# EAGLE design v2.1 (EAGLE 6.5.0)
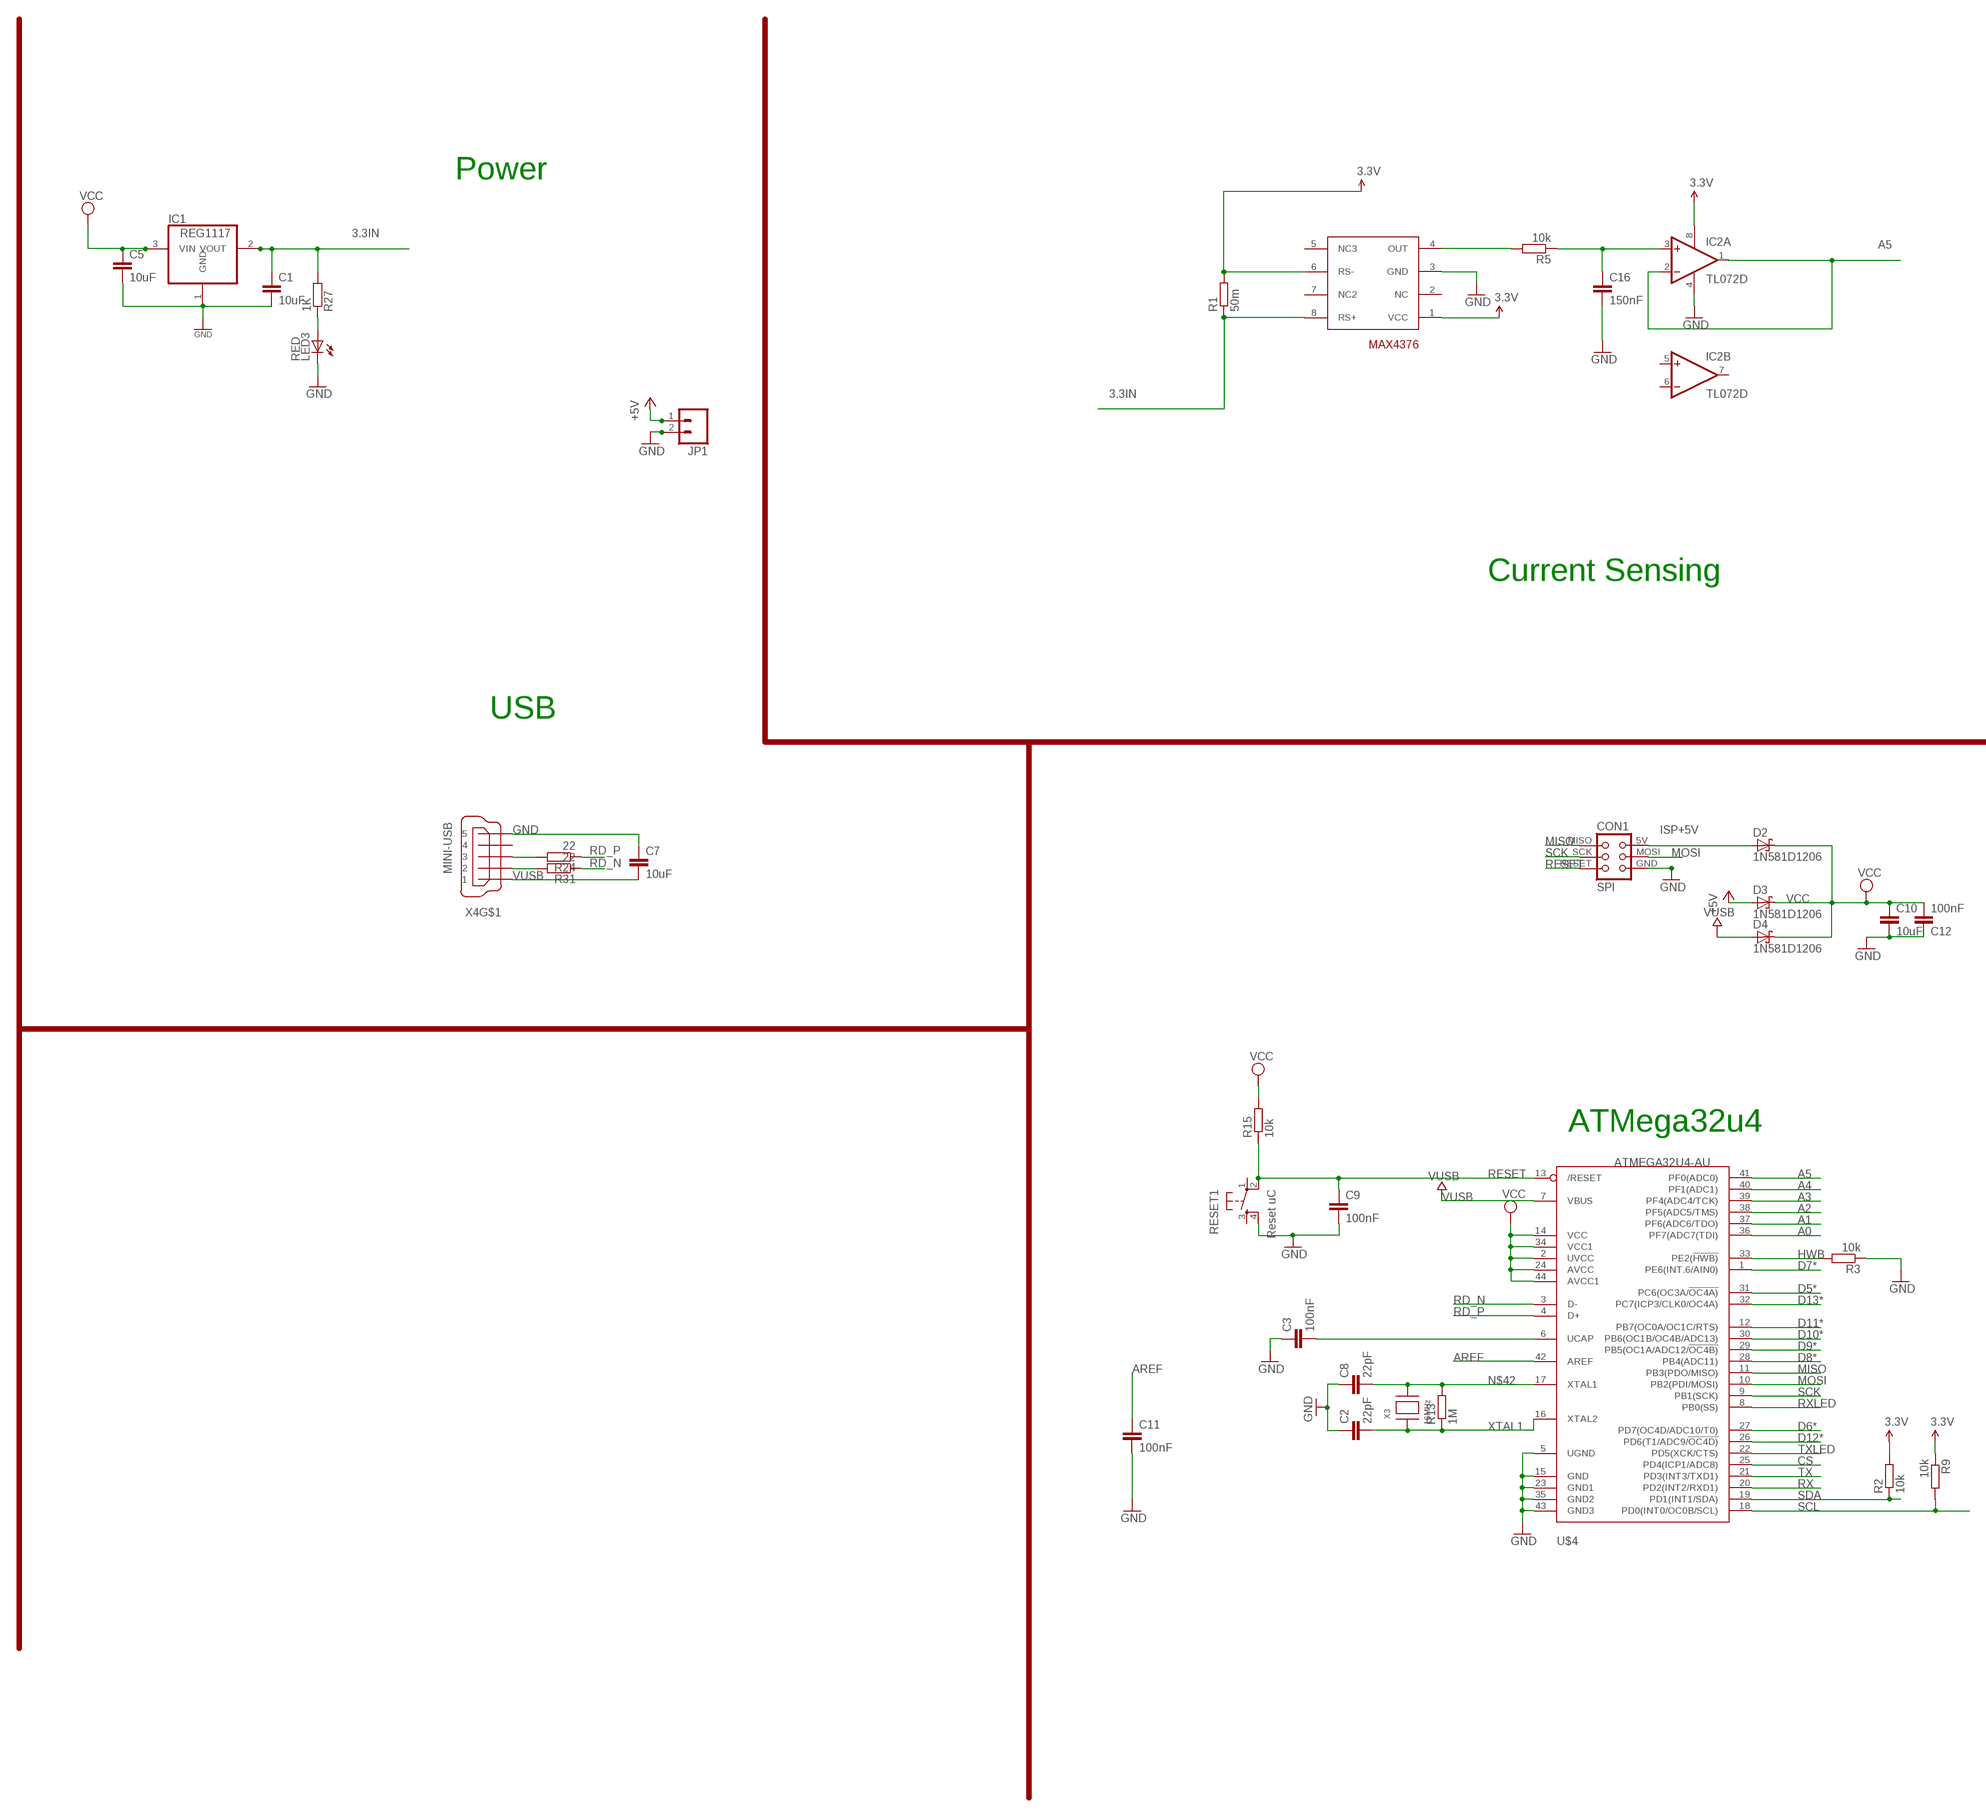
[diagram p0: schematic, sheet 1, part 1 of 2]
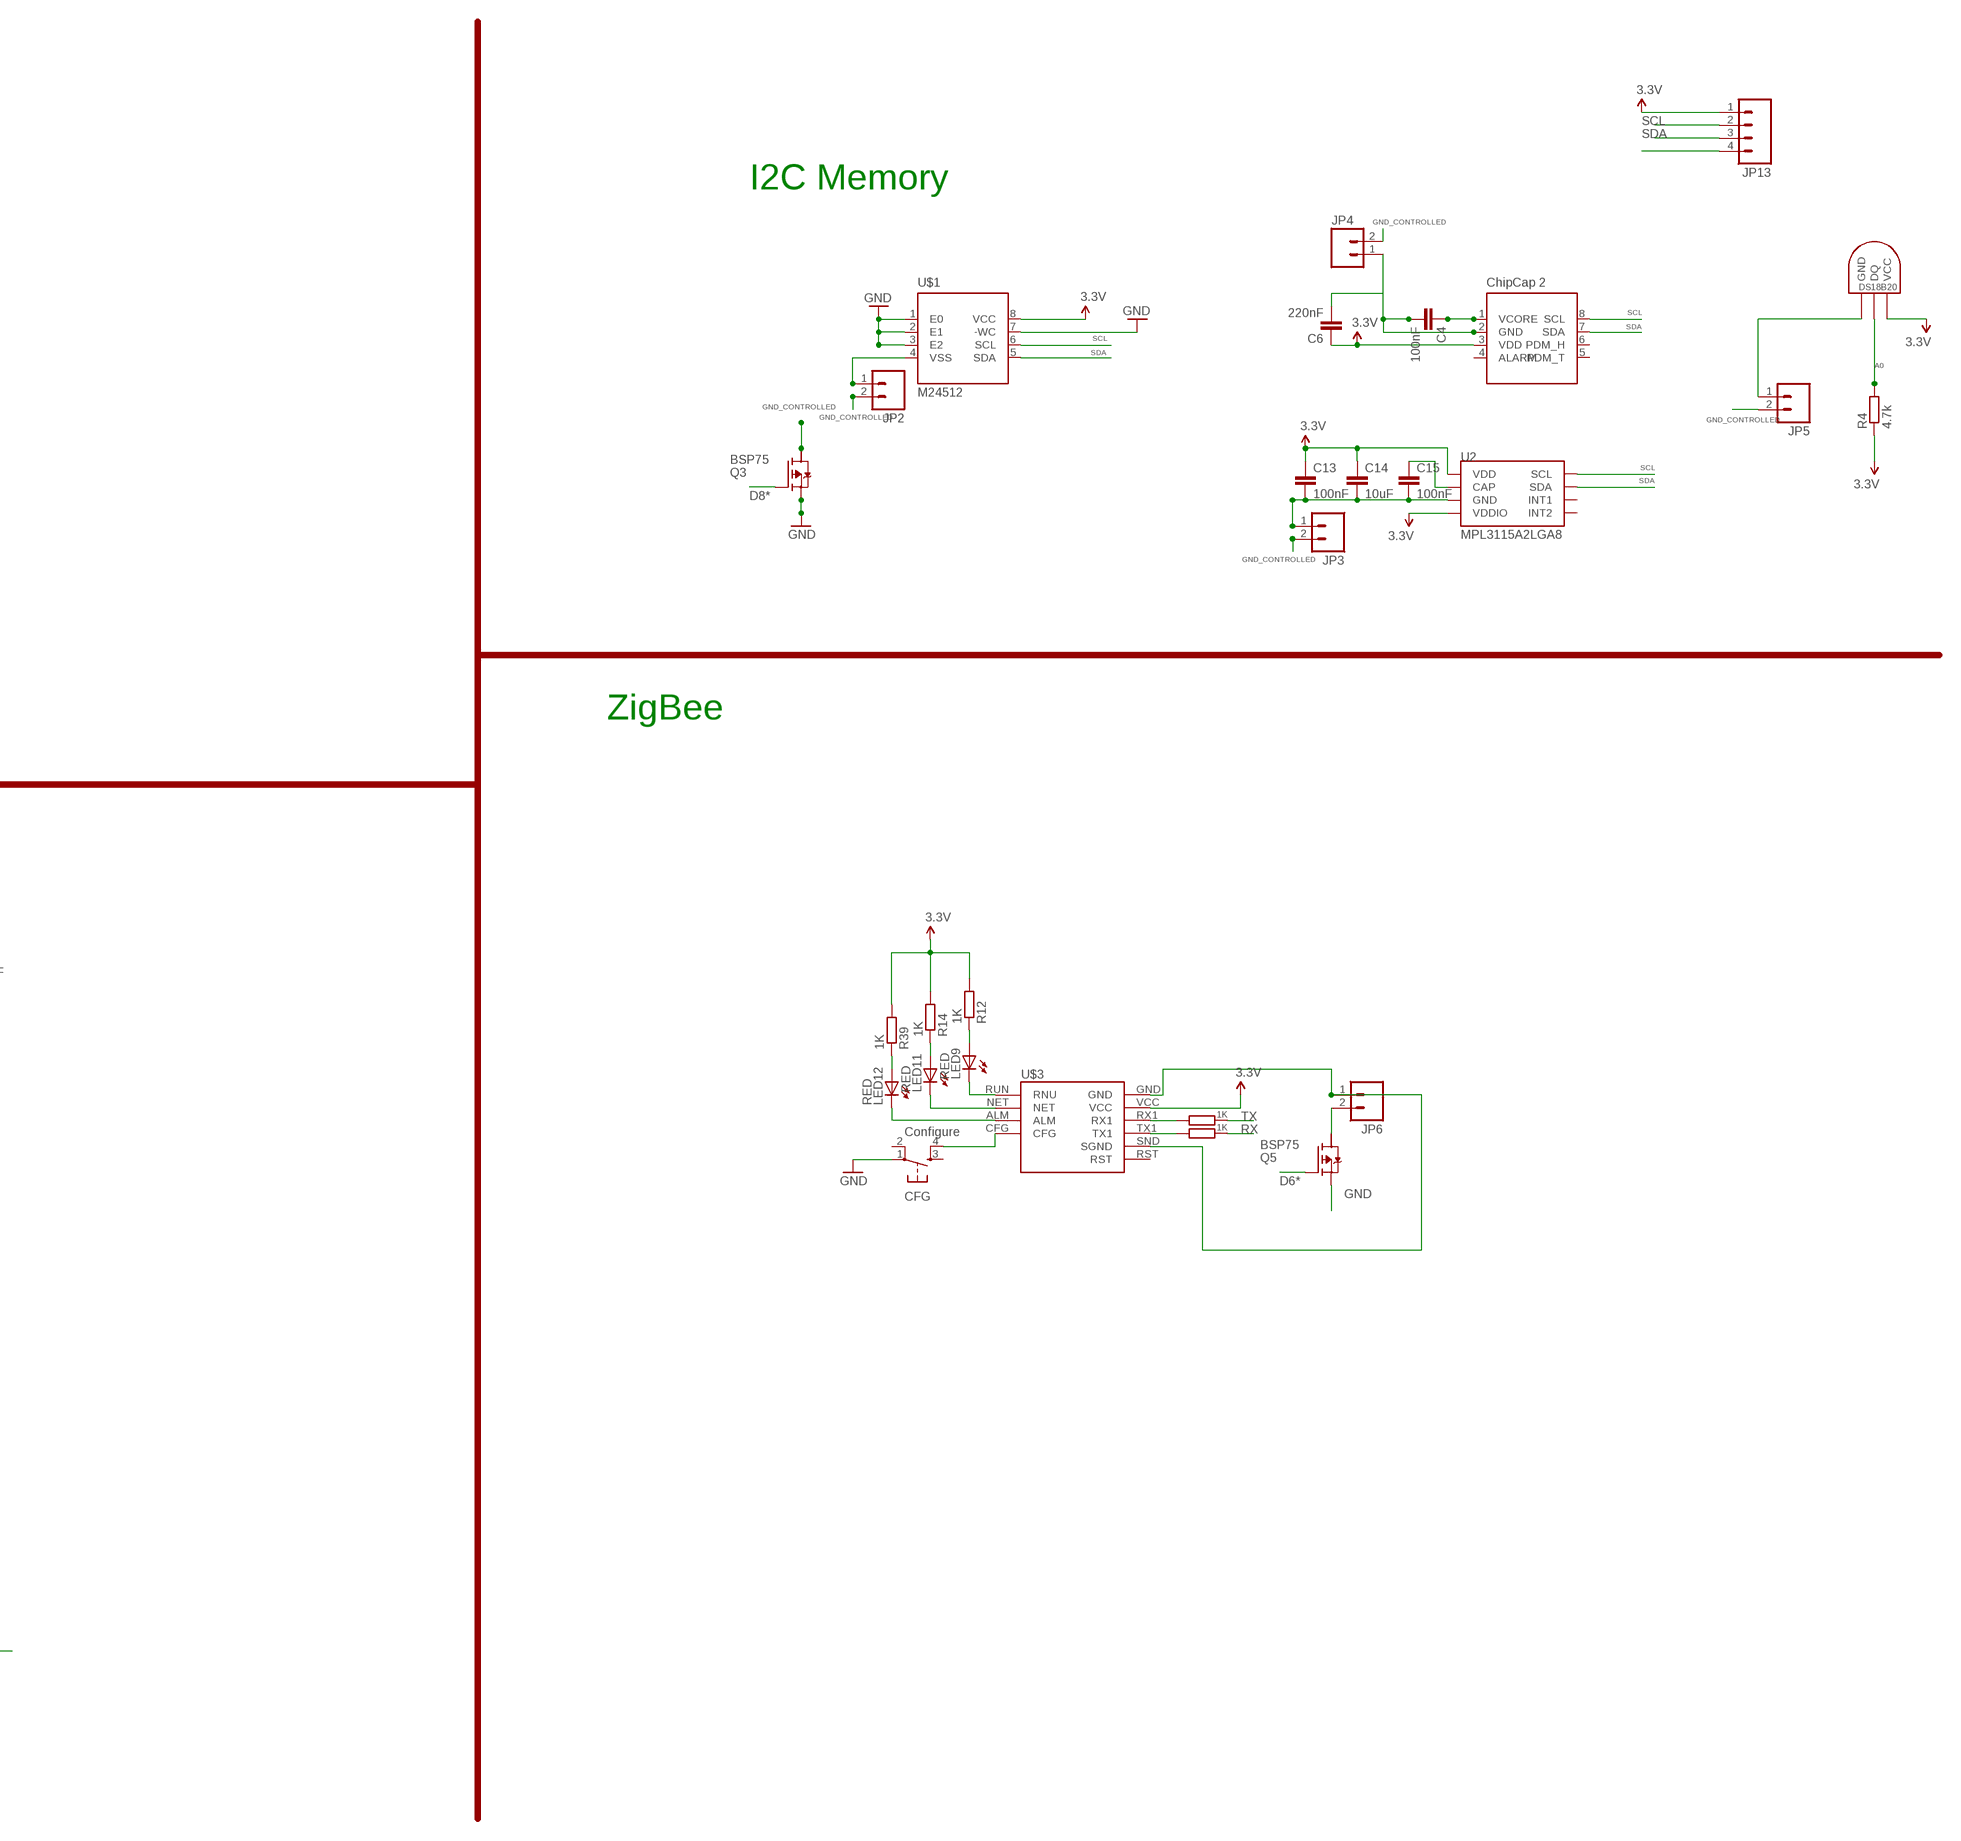
[diagram p1: schematic, sheet 1, part 2 of 2]

## Parts
C1  10uF  C-EUC1206  [C1206]
C2  22pF  C-EUC1206  [C1206]
C3  100nF  C-EUC1206  [C1206]
C4  100nF  C-EUC1206  [C1206]
C5  10uF  C-EUC1206  [C1206]
C6  220nF  C-EUC1206  [C1206]
C7  10uF  C-EUC1206  [C1206]
C8  22pF  C-EUC1206  [C1206]
C9  100nF  C-EUC1206  [C1206]
C10  10uF  C-EUC1206  [C1206]
C11  100nF  C-EUC1206  [C1206]
C12  100nF  C-EUC1206  [C1206]
C13  100nF  C-EUC1206  [C1206]
C14  10uF  C-EUC1206  [C1206]
C15  100nF  C-EUC1206  [C1206]
C16  150nF  C-EUC1206  [C1206]
CFG  Configure  TAC_SWITCHSMD  [TACTILE_SWITCH_SMD]
CON1  SPI  TINYISPT  [TC2030-MCP-NL]
D2  1N581D1206  [LED-1206]
D3  1N581D1206  [LED-1206]
D4  1N581D1206  [LED-1206]
IC1  REG1117  [SOT223]
IC2  TL072D  [SO08]
JP1  M02LOCK_LONGPADS  [1X02_LOCK_LONGPADS]
JP2  M02LOCK_LONGPADS  [1X02_LOCK_LONGPADS]
JP3  M02LOCK_LONGPADS  [1X02_LOCK_LONGPADS]
JP4  M02LOCK_LONGPADS  [1X02_LOCK_LONGPADS]
JP5  M02LOCK_LONGPADS  [1X02_LOCK_LONGPADS]
JP6  M02LOCK_LONGPADS  [1X02_LOCK_LONGPADS]
JP13  M04LOCK_LONGPADS  [1X04_LOCK_LONGPADS]
LED3  RED  LEDCHIP-LED0805  [CHIP-LED0805]
LED9  RED  LEDCHIP-LED0805  [CHIP-LED0805]
LED11  RED  LEDCHIP-LED0805  [CHIP-LED0805]
LED12  RED  LEDCHIP-LED0805  [CHIP-LED0805]
Q3  BSP75  BSP613P  [PG-SOT-223]
Q5  BSP75  BSP613P  [PG-SOT-223]
R1  50m  R-EU_R1206  [R1206]
R2  10k  R-EU_M1206  [M1206]
R3  10k  R-EU_M0805  [M0805]
R4  4.7k  R-EU_M1206  [M1206]
R5  10k  R-EU_R1206  [R1206]
R8  1K  R-EU_R0805  [R0805]
R9  10k  R-EU_M1206  [M1206]
R11  1K  R-EU_R0805  [R0805]
R12  1K  R-EU_R0805  [R0805]
R13  1M  R-EU_R1206  [R1206]
R14  1K  R-EU_R0805  [R0805]
R15  10k  R-EU_M0805  [M0805]
R24  22  R-EU_M1206  [M1206]
R27  1K  R-EU_R0805  [R0805]
R31  22  R-EU_M1206  [M1206]
R39  1K  R-EU_R0805  [R0805]
RESET1  Reset uC  TAC_SWITCHSMD  [TACTILE_SWITCH_SMD]
U2  MPL3115A2LGA8  [LGA8]
U$1  M24512  [SO8]
U$2  CHIPCAP  [CHIPCAP]
U$3  SZ05-ZIGBEETHROUGHHOLE  [SZ05-ZIGBEE4]
U$4  ATMEGA32U4-AU  [TQFP44]
U$5  MAX4376F  [SO8]
U$6  DS1820  [µSOP8]
X3  16MHz  XTALNX6035  [NX6035]
X4  MINI-USB  MINI-USB-SCHIELD-32005-201  [32005-201]

## Nets
3.3IN [power]: C1.1 IC1.2(VOUT) R1.1 R27.2 U$5.8(RS+)
3.3V [power]: C6.1 C13.1 C14.1 IC2.8(P:V+) JP13.1 R1.2 R2.2 R4.1 R9.1 R12.2 R14.2 R39.2 U2.1(VDD) U2.4(VDDIO) U$1.8(VCC) U$2.3(VDD) U$3.VCC U$5.1(VCC) U$5.6(RS-) U$6.8(VCC)
$1: C13.2 C14.2 C15.2 JP3.1 U2.3(GND)
$2: C4.2 C6.2 JP4.1 U$2.2(GND)
$3: JP5.1 U$6.4(GND)
$12: JP2.1 U$1.4(VSS)
+5V [power]: D3.A JP1.1
A0: R4.2 U$4.36(PF7(ADC7(TDI)) U$6.1(DQ)
A1: U$4.37(PF6(ADC6/TDO))
A2: U$4.38(PF5(ADC5/TMS))
A3: U$4.39(PF4(ADC4/TCK))
A4: U$4.40(PF1(ADC1))
A5: IC2.1(A:OUT) IC2.2(A:-IN) U$4.41(PF0(ADC0))
AREF: C11.1 U$4.42(AREF)
CS: U$4.25(PD4(ICP1/ADC8))
D5*: U$4.31(PC6(OC3A/!OC4A))
D6*: Q5.1(G) U$4.27(PD7(OC4D/ADC10/T0))
D7*: U$4.1(PE6(INT.6/AIN0))
D8*: Q3.1(G) U$4.28(PB4(ADC11))
D9*: U$4.29(PB5(OC1A/ADC12/!OC4B))
D10*: U$4.30(PB6(OC1B/OC4B/ADC13))
D11*: U$4.12(PB7(OC0A/OC1C/RTS))
D12*: U$4.26(PD6(T1/ADC9/!OC4D))
D13*: U$4.32(PC7(ICP3/CLK0/OC4A))
D+USB: R24.2 X4.3
D-USB: R31.2 X4.2
GND [power]: C1.2 C2.1 C3.1 C5.2 C7.1 C8.1 C9.2 C10.2 C11.2 C12.1 C16.2 CFG.1 CON1.GND IC1.1(GND) IC2.4(P:V-) JP1.2 LED3.C Q3.3(S) Q5.3(S) R3.1 RESET1.4 U$1.1(E0) U$1.2(E1) U$1.3(E2) U$1.7(-WC) U$4.5(UGND) U$4.15(GND) U$4.23(GND1) U$4.35(GND2) U$4.43(GND3) U$5.3(GND) X4.5
GND1 [VIN]: LED9.C U$3.RUN(RNU)
GND2 [VIN]: LED11.C U$3.NET
GND3 [VIN]: LED12.C U$3.ALM
GND_CONTROLLED [power]: JP2.2 JP3.2 JP4.2 JP5.2 JP13.4 Q3.2(D)
HWB: R3.2 U$4.33(PE2(!HWB))
ISP+5V: CON1.5V(VCC) D2.A
MISO: CON1.MISO U$4.11(PB3(PDO/MISO))
MOSI: CON1.MOSI U$4.10(PB2(PDI/MOSI))
N$1: R5.2 U$5.4(OUT)
N$2: JP6.2 Q5.2(D)
N$3: C16.1 IC2.3(A:+IN) R5.1
N$4 [power]: JP6.1 U$3.GND U$3.SND(SGND)
N$6: C4.1 U$2.1(VCORE)
N$11: R11.2 U$3.RX1
N$13: C15.1 U2.2(CAP)
N$16: C3.2 U$4.6(UCAP)
N$20: LED3.A R27.1
N$24: R8.2 U$3.TX1
N$25: LED9.A R12.1
N$26: LED11.A R14.1
N$27: LED12.A R39.1
N$35: CFG.4 U$3.CFG
N$42: C8.2 R13.2 U$4.17(XTAL1) X3.P$2
RD_N: R31.1 U$4.3(D-)
RD_P: R24.1 U$4.4(D+)
RESET: C9.1 CON1.RESET R15.1 RESET1.2 U$4.13(/RESET)
RX: R8.1 U$4.20(PD2(INT2/RXD1))
RXLED: U$4.8(PB0(SS))
SCK: CON1.SCK U$4.9(PB1(SCK))
SCL: JP13.2 R9.2 U2.8(SCL) U$1.6(SCL) U$2.8(SCL) U$4.18(PD0(INT0/OC0B/SCL))
SDA: JP13.3 R2.1 U2.7(SDA) U$1.5(SDA) U$2.7(SDA) U$4.19(PD1(INT1/SDA))
TX: R11.1 U$4.21(PD3(INT3/TXD1))
TXLED: U$4.22(PD5(XCK/CTS))
VCC [fine]: C5.1 C10.1 C12.2 D2.C D3.C D4.C IC1.3(VIN) R15.2 U$4.2(UVCC) U$4.14(VCC) U$4.24(AVCC) U$4.34(VCC1) U$4.44(AVCC1)
VUSB: C7.2 D4.A U$4.7(VBUS) X4.1
XTAL1: C2.2 R13.1 U$4.16(XTAL2) X3.P$1
Unconnected: CFG.2 CFG.3 IC2.5(B:+IN) IC2.6(B:-IN) IC2.7(B:OUT) Q3.4(D) Q5.4(D) RESET1.1 RESET1.3 U2.5(INT2) U2.6(INT1) U$2.4(ALARM) U$2.5(PDM_T) U$2.6(PDM_H) U$3.RST U$5.2(NC) U$5.5(NC3) U$5.7(NC2) X4.4 X4.M1(S:S1) X4.M2(S:S2) X4.M3(S:S3) X4.M4(S:S4)

## Notes on the sheet
- Power
- I2C Memory
- Current Sensing
- ZigBee
- USB
- ATMega32u4

## Library data of the parts
C1-C16 = rcl:C-EU: CAPACITOR, European symbol
CFG RESET1 = lpatiny:TAC_SWITCH: Momentary Switch Button commonly used for reset or general input. Spark Fun Electronics SKU : COM-00097
CON1 = lpatiny:TINYISP: CONNECTOR
D2-D4 = lpatiny:1N581*: 1.0A SCHOTTKY BARRIER RECTIFIER Source: http://www.diodes.com/datasheets/ds23001.pdf
IC1 = burr-brown:REG1117: 800mA and 1A Low Dropout (LDO) Positive Regulator 1.8V, 2.5V, 2.85V, 3.3V, 5V, and Adj; MPN: REG1117; OC_FARNELL: 1097566; OC_NEWARK: 14P6981
IC2 = linear:TL072: OP AMP
JP1-JP6 = SparkFun:M02: Header 2 Standard 2-pin 0.1" header. Use with straight break away headers (SKU : PRT-00116), right angle break away headers (PRT-00553), swiss pins (PRT-00743), machine pins (PRT-00117), and female headers (PRT-00115). Molex polarized connector foot print use with SKU : PRT-08233 with associated crimp pins and housings.
JP13 = SparkFun:M04: Header 4 Standard 4-pin 0.1" header. Use with straight break away headers (SKU : PRT-00116), right angle break away headers (PRT-00553), swiss pins (PRT-00743), machine pins (PRT-00117), and female headers (PRT-00115). Molex polarized connector foot print use with SKU : PRT-08231 with associated crimp pins and housings. 1MM SMD Version SKU: PRT-10208
LED3 LED9 LED11 LED12 = adafruit:LED: LED OSRAM: - CHIPLED LG R971, LG N971, LY N971, LG Q971, LY Q971, LO R971, LY R971 LH N974, LH R974 LS Q976, LO Q976, LY Q976 LO Q996 - Hyper CHIPLED LW Q18S LB Q993, LB Q99A, LB R99A - SideLED LS A670, LO A670, LY A670, LG A670, LP A670 LB A673, LV A673, LT A673, LW A673 LH A674 LY A675 LS A676, LA A676, LO A676, LY A676, LW A676 LS A679, LY A679, LG A679 - Hyper Micro SIDELED® LS Y876, LA Y876, LO Y876, LY Y876 LT Y87S - SmartLED LW L88C, LW L88S LB L89C, LB L89S, LG L890 LS L89K, LO L89K, LY L89K LS L896, LA L896, LO L896, LY L896 - TOPLED LS T670, LO T670, LY T670, LG T670, LP T670 LSG T670, LSP T670, LSY T670, LOP T670, LYG T670 LG T671, LOG T671, LSG T671 LB T673, LV T673, LT T673, LW T673 LH T674 LS T676, LA T676, LO T676, LY T676, LB T676, LH T676, LSB T676, LW T676 LB T67C, LV T67C, LT T67C, LS T67K, LO T67K, LY T67K, LW E67C LS E67B, LA E67B, LO E67B, LY E67B, LB E67C, LV E67C, LT E67C LW T67C LS T679, LY T679, LG T679 LS T770, LO T770, LY T770, LG T770, LP T770 LB T773, LV T773, LT T773, LW T773 LH T774 LS E675, LA E675, LY E675, LS T675 LS T776, LA T776, LO T776, LY T776, LB T776 LHGB T686 LT T68C, LB T68C - Hyper Mini TOPLED® LB M676 - Mini TOPLED Santana® LG M470 LS M47K, LO M47K, LY M47K Source: http://www.osram.convergy.de/
Q3 Q5 = infineon:BSP613P: SIPMOS (R) Small-Signal-Transistor P-Channel (2 Drain) Source: http://www.infineon.com/dgdl/BSP613P_Rev2.4.pdf; OC_FARNELL: unknown; OC_NEWARK: unknown
R1 R5 R8 R11-R14 R27 R39 = rcl:R-EU_: RESISTOR, European symbol
R2-R4 R9 R15 R24 R31 = resistor:R-EU_: RESISTOR, European symbol
U2 = SparkFun-Sensors-hacked:MPL3115A2: Altimeter/Pressure Sensor, I2C, 1.95V-3.6V supply, 50 to 110kPa
U$1 = lpatiny:M24512
U$2 = lpatiny:CHIPCAP
U$3 = lpatiny:SZ05-ZIGBEE
U$4 = adafruit:ATMEGA32U4: http://www.ladyada.net/library/eagle
U$5 = lpatiny:MAX4376F
U$6 = Ava:DS1820: DS18B20 Programmable Resolution 1-Wire Digital Thermometer Description The DS18B20 digital thermometer provides 9-bit to 12-bit Celsius temperature measurements and has an alarm function with nonvolatile user-programmable upper and lower trigger points. The DS18B20 communicates over a 1-Wire® bus that by definition requires only one data line (and ground) for communication with a central microprocessor. It has an operating temperature range of -55°C to +125°C and is accurate to ±0.5°C over the range of -10°C to +85°C. In addition, the DS18B20 can derive power directly from the data line ("parasite power"), eliminating the need for an external power supply. Each DS18B20 has a unique 64-bit serial code, which allows multiple DS18B20s to function on the same 1-Wire bus. Thus, it is simple to use one microprocessor to control many DS18B20s distributed over a large area. Applications that can benefit from this feature include HVAC environmental controls, temperature monitoring systems inside buildings, equipment, or machinery, and process monitoring and control systems.
X3 = lpatiny:XTAL: Low cost SMT crystals, no capacitors included http://www.ladyada.net/library/eagle
X4 = con-cypressindustries:MINI-USB-SCHIELD-: MINI USB-B Conector Source: www.cypressindustries.com; OC_FARNELL: unknown; OC_NEWARK: unknown

## Net classes
0 default: width 0.305 mm
1 power: width 0.61 mm
2 VIN: width 0.457 mm
3 fine: width 0.305 mm
4 aref: width 0.305 mm

## Board
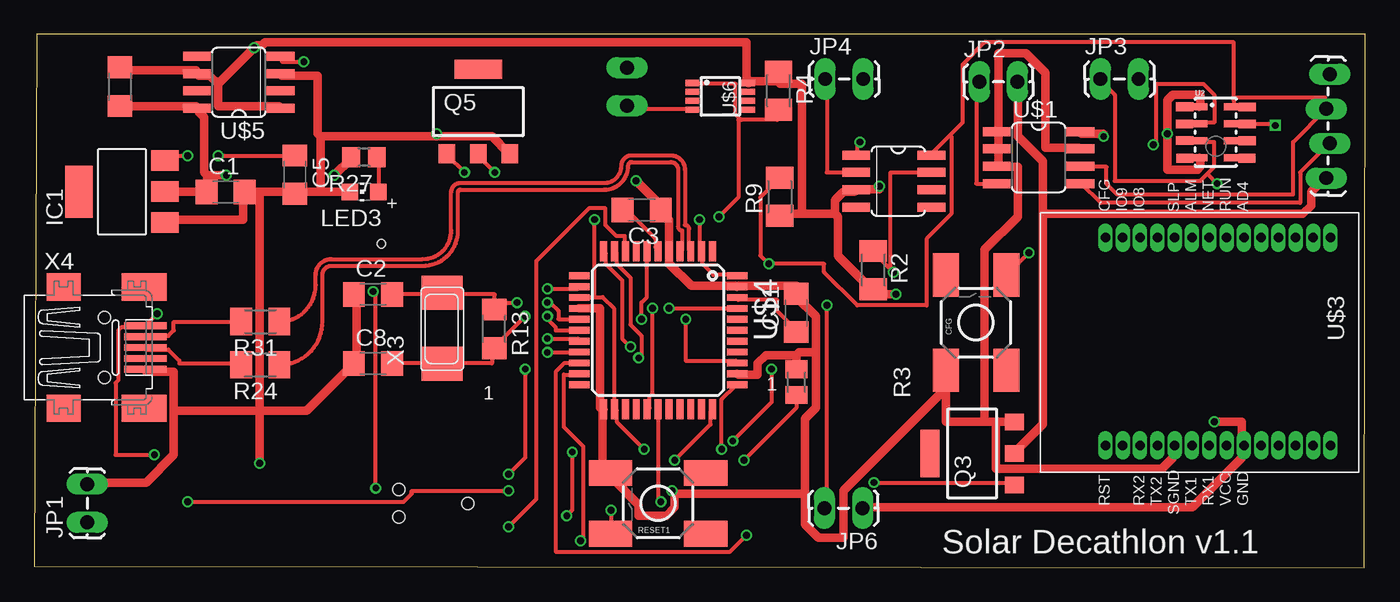
[diagram p2: board, top side]
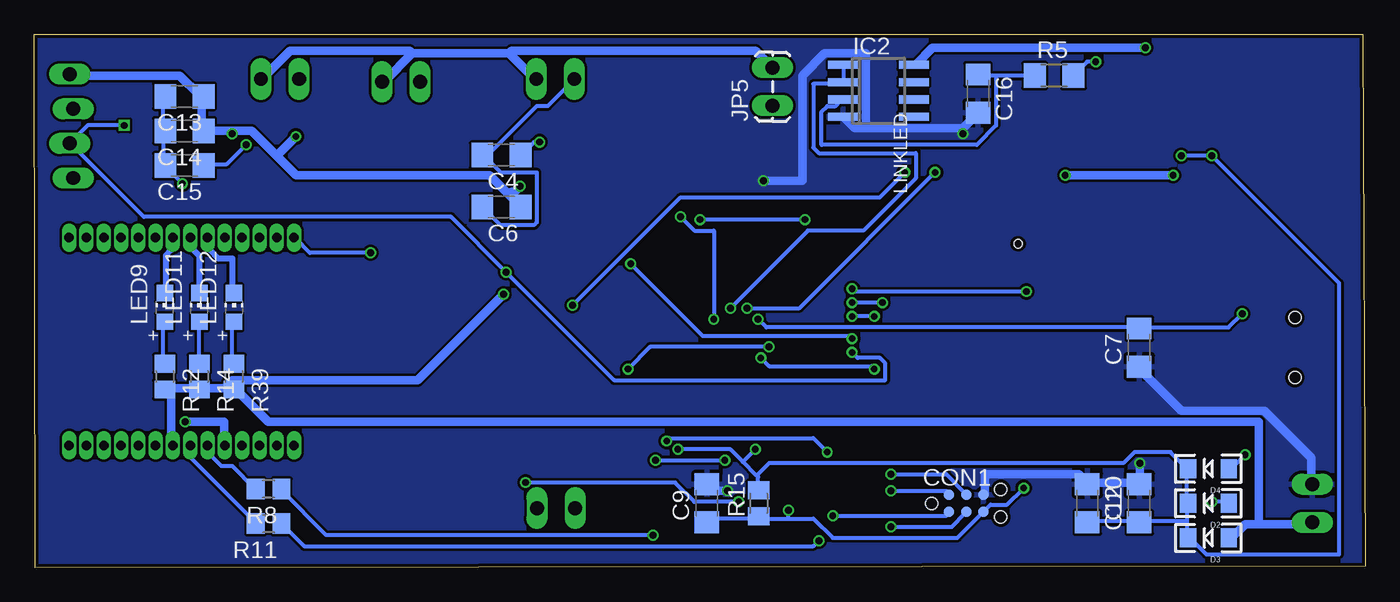
[diagram p3: board, bottom side, seen from below]

Size 97.76 x 39.16 mm. Coordinates in mm from the lower left corner, seen from the top.
Outline: 0,0.1 97.66,0 97.76,39.16 0.2,39.16 0,0.1
Copper layers (1*16): Top 0.035mm / dielectric 1.5mm / Bottom 0.035mm
Design rules "Fusion_eagle_rule_v1.1 *": minimum track width 6mil, minimum drill 0.5mm, track to track 7.5mil, track to pad 7.5mil, pad to pad 7.5mil, via to via 7.5mil, smd to smd 0mil, copper to edge 10mil, drill to drill 10mil, minimum pad ring 6mil, minimum via ring 6mil, stop-mask expansion 2mil, vias tented up to drill 100mil, thermal gap 10mil
Holes 0.6 mm at 25.5,23.77
bKeepout: area -1.2,56.8 to 114.4,84.7; area -7.5,54.3 to 108.1,82.2
vRestrict: area 38.2,20 to 53.4,25; area 38.2,9.8 to 53.4,14.9; area 48.4,9.8 to 53.4,25; area 38.2,9.8 to 43.3,25; area 25.5,0.9 to 34.4,8.5

### Footprints (pad centres in the part's own frame; a part is rotated, then mirrored left to right if it is on the bottom)
C1206 = smd 1.6 x 1.8: 1 -1.4,0; 2 1.4,0
TACTILE_SWITCH_SMD = smd 3.175 x 1.905: 1 -3.493,2.223; 2 3.493,2.223; 3 -3.493,-2.223; 4 3.493,-2.223
TC2030-MCP-NL = smd 0.787 x 0.787: 5V 1.27,0.635; GND 3.81,0.635; MISO 1.27,-0.635; MOSI 2.54,0.635; RESET 3.81,-0.635; SCK 2.54,-0.635 | hole 0.889: 0,0; 5.08,-1.016; 5.08,1.016
LED-1206 = smd 1.2 x 1.4: A -1.5,0; C 1.5,0
SOT223 = smd 1.499 x 2.007: 1 -2.261,-3.15; 2 0.025,-3.15; 3 2.311,-3.15 | smd 3.81 x 2.007: 4 0,3.15
SO08 = smd 0.6 x 2.2: 1 -1.905,-2.6; 2 -0.635,-2.6; 3 0.635,-2.6; 4 1.905,-2.6; 5 1.905,2.6; 6 0.635,2.6; 7 -0.635,2.6; 8 -1.905,2.6
1X02_LOCK_LONGPADS = drill 1.016 long: 1 -0.127,0; 2 2.667,0
1X04_LOCK_LONGPADS = drill 1.016 long: 1 0,0; 2 2.54,-0.254; 3 5.08,0; 4 7.62,-0.254
CHIP-LED0805 = smd 1.2 x 1.2: A 0,-1.05; C 0,1.05
PG-SOT-223 = smd 1.2 x 1.4: 1 -2.311,-3.099; 2 0,-3.099; 3 2.311,-3.099 | smd 3.5 x 1.4: 4 0,3.099
R1206 = smd 1.6 x 1.803: 1 -1.422,0; 2 1.422,0
M1206 = smd 1.6 x 2: 1 -1.4,0; 2 1.4,0
M0805 = smd 1.3 x 1.6: 1 -0.95,0; 2 0.95,0
R0805 = smd 1.3 x 1.5: 1 -0.95,0; 2 0.95,0
LGA8 = smd 1.2 x 0.5: 1 -1.2,1.875; 2 -1.2,0.625; 3 -1.2,-0.625; 4 -1.2,-1.875; 5 1.2,-1.875; 6 1.2,-0.625; 7 1.2,0.625; 8 1.2,1.875 | smd 1.27 x 0.635: P$1 -2.286,1.876; P$2 2.313,1.867; P$3 2.301,0.605; P$4 2.299,-0.617; P$5 2.29,-1.898; P$6 -2.297,0.609; P$7 -2.281,-0.609; P$8 -2.264,-1.901
SO8 = smd 0.66 x 2.032: 1 -3.81,-3.073; 2 -2.54,-3.073; 3 -1.27,-3.073; 4 0,-3.073; 5 0,3.073; 6 -1.27,3.073; 7 -2.54,3.073; 8 -3.81,3.073
CHIPCAP = smd 0.66 x 2.032: 1 -2.54,-3.073; 2 -1.27,-3.073; 3 0,-3.073; 4 1.27,-3.073; 5 1.27,2.438; 6 0,2.438; 7 -1.27,2.438; 8 -2.54,2.438
SZ05-ZIGBEE4 = drill 0.7 pad 1.016 long: AD1 -6.985,6.35; AD2 -6.985,5.08; AD3 -6.985,3.81; AD4 -6.985,2.54; ALM -6.985,-1.27; C485 -6.985,-3.81; CFG -6.985,-7.62; GND 8.255,2.54; IO1 -6.985,8.89; IO2 -6.985,7.62; IO3 8.255,8.89; IO4 8.255,7.62; IO5 8.255,6.35; IO6 8.255,5.08; IO7 8.255,3.81; IO8 -6.985,-5.08; IO9 -6.985,-6.35; MS 8.255,-6.35; NET -6.985,0; RST 8.255,-7.62; RUN -6.985,1.27; RX1 8.255,0; RX2 8.255,-5.08; SLD -6.985,-2.54; SND 8.255,-2.54; TX1 8.255,-1.27; TX2 8.255,-3.81; VCC 8.255,1.27
TQFP44 = smd 1.5 x 0.5: 1 -5.8,4; 2 -5.8,3.2; 3 -5.8,2.4; 4 -5.8,1.6; 5 -5.8,0.8; 6 -5.8,0; 7 -5.8,-0.8; 8 -5.8,-1.6; 9 -5.8,-2.4; 10 -5.8,-3.2; 11 -5.8,-4; 23 5.8,-4; 24 5.8,-3.2; 25 5.8,-2.4; 26 5.8,-1.6; 27 5.8,-0.8; 28 5.8,0; 29 5.8,0.8; 30 5.8,1.6; 31 5.8,2.4; 32 5.8,3.2; 33 5.8,4 | smd 0.5 x 1.5: 12 -4,-5.8; 13 -3.2,-5.8; 14 -2.4,-5.8; 15 -1.6,-5.8; 16 -0.8,-5.8; 17 0,-5.8; 18 0.8,-5.8; 19 1.6,-5.8; 20 2.4,-5.8; 21 3.2,-5.8; 22 4,-5.8; 34 4,5.8; 35 3.2,5.8; 36 2.4,5.8; 37 1.6,5.8; 38 0.8,5.8; 39 0,5.8; 40 -0.8,5.8; 41 -1.6,5.8; 42 -2.4,5.8; 43 -3.2,5.8; 44 -4,5.8
µSOP8 = smd 0.45 x 1: 1 -0.975,-2.05; 2 -0.325,-2.05; 3 0.325,-2.05; 4 0.975,-2.05; 5 0.975,2.05; 6 0.325,2.05; 7 -0.325,2.05; 8 -0.975,2.05
NX6035 = smd 2.5 x 3: P$1 2.665,0; P$2 -2.565,0
32005-201 = smd 3.1 x 0.5: 1 3,1.6; 2 3,0.8; 3 3,0; 4 3,-0.8; 5 3,-1.6 | smd 2.5 x 2: M1 -3,-4.45; M2 -3,4.45 | smd 3.3 x 2: M3 2.9,4.45; M4 2.9,-4.45 | hole 0.9: 0,2.2; 0,-2.2

### Placement (x,y rotation side)
C1  14.07,27.58 0 top
C2  24.89,20.07 0 top
C3  44.62,26.26 180 top
C4  63.45,30.28 180 bottom
C5  19.15,28.85 270 top
C6  63.45,26.47 180 bottom
C7  16.61,16.15 90 bottom
C8  24.89,14.99 0 top
C9  48.36,4.72 90 bottom
C10  16.61,4.72 90 bottom
C11  55.98,18.69 90 top
C12  20.42,4.72 270 bottom
C13  86.72,34.59 180 bottom
C14  86.72,32.05 180 bottom
C15  86.72,29.51 180 bottom
C16  28.45,34.8 270 bottom
CFG  69.16,17.98 90 top
CON1  31.85,4.72 0 bottom
D2  11.53,4.72 180 bottom
D3  11.53,2.18 180 bottom
D4  11.53,7.26 180 bottom
IC1  6.45,27.58 90 top
IC2  35.76,35 270 bottom
JP1  3.91,3.45 90 top
JP2  69.55,35.66 0 top
JP3  78.44,35.86 0 top
JP4  58.22,35.86 0 top
JP5  43.54,34.04 90 bottom
JP6  60.71,4.37 180 top
JP13  95.15,36.22 270 top
LED3  24.23,27.58 90 top
LED9  88.16,19.1 0 bottom
LED11  85.62,19.1 0 bottom
LED12  83.08,19.1 0 bottom
Q3  68.88,8.38 90 top
Q5  32.61,33.48 0 top
R1  6.3,35.31 90 top
R2  61.62,21.84 270 top
R3  55.98,13.61 270 top
R4  54.66,35 270 top
R5  22.86,36.12 0 bottom
R8  80.54,5.77 180 bottom
R9  54.76,27.23 90 top
R11  80.54,3.23 180 bottom
R12  88.16,14.02 270 bottom
R13  33.78,17.53 270 top
R14  85.62,14.02 270 bottom
R15  44.55,4.72 90 bottom
R24  16.61,14.88 180 top
R27  24.23,30.12 180 top
R31  16.61,18.06 180 top
R39  83.08,14.02 270 bottom
RESET1  45.82,4.72 180 top
U2  86.77,31.95 0 top
U$1  73.76,28.19 270 top
U$2  63.45,27.74 270 top
U$3  86.3,17.23 270 top
U$4  45.82,17.42 270 top
U$5  15.04,37.54 90 top
U$6  50.39,34.59 270 top
X3  29.97,17.53 90 top
X4  5.18,16.15 0 top

### Tracks (layer width: path | path; a pad name or v marks a point on that pad's centre or on a via)
3.3IN  (via drill 0.5)
  Top 0.61: R1.1 6.4,33.88 11.89,33.88 U$5.8 12.09,33.48 12.5,33.07 12.5,29.01 12.7,28.8 | v22.05,28.8 23.27,30.02 R27.2 | 12.7,28.8 v14.12,28.8 | 12.7,28.8 12.7,27.58 C1.1 9.65,27.58 IC1.2
  Bottom 0.61: v14.12,28.8 v22.05,28.8
3.3V  (via drill 0.5)
  Top 0.61: R1.2 6.4,36.53 11.89,36.53 11.89,36.32 U$5.6 12.09,36.12 12.9,36.12 13.51,35.51 | 13.51,35.51 13.51,33.88 17.98,33.88 U$5.1 | 13.51,35.51 v16.15,38.15 16.36,38.35 16.76,38.35 16.97,38.56 52.32,38.56 52.32,35.92 52.53,35.71 | 54.56,35.71 52.53,35.71 | 54.56,35.71 54.56,36.32 R4.1 | 52.53,35.71 U$6.8 | 58.83,25.96 56.39,25.96 | 56.39,25.96 54.76,25.96 R9.1 | 58.83,25.96 58.83,26.97 59.44,27.58 60.25,27.58 U$2.3 60.66,27.79 62.08,27.79 v62.08,27.99 | 58.83,25.96 59.03,25.76 59.03,22.91 61.47,20.47 R2.2 61.87,20.27 61.87,20.07 v63.3,20.07 | 56.39,25.96 56.39,35.51 54.76,35.51 54.56,35.71 | U2.4 85.65,30.02 85.65,29.41 85.45,29.21 83.21,29.21 v83.21,31.85 83.21,34.29 83.62,34.7 85.65,34.7 85.65,33.88 U2.1 | v78.54,31.65 78.54,31.85 76.91,31.85 U$1.8
  Bottom 0.61: v16.15,38.15 31.8,38.15 33.02,36.93 IC2.8 | 62.89,27.38 64.31,28.8 78.54,28.8 79.96,30.23 | 62.89,27.38 62.08,26.57 C6.1 | 79.96,30.23 81.79,32.05 83.21,32.05 | 83.21,32.05 C14.1 85.45,32.26 85.45,34.49 C13.1 85.65,34.7 87.07,36.12 95,36.12 JP13.1 | 79.96,30.23 v78.54,31.65 | v83.21,31.85 83.21,32.05 | v62.08,27.99 62.48,27.58 62.69,27.58 62.89,27.38 | U$3.VCC 87.68,9.09 87.68,12.95 R12.2 88.09,13.16 85.85,13.16 R14.2 85.45,13.16 83.21,13.16 R39.2 83.62,13.36 83.21,13.77 69.6,13.77 v63.3,20.07
$1  (via drill 0.5)
  Top 0.305: 86.16,28.91 85.65,28.4 79.35,28.4 79.35,34.7 78.33,35.71 JP3.1 | 86.16,28.91 86.66,29.41 86.66,31.24 85.65,31.24 U2.3 | 86.16,28.91 v86.87,28.19
  Bottom 0.305: 88.29,32.05 88.29,29.62 C15.2 88.09,29.41 v86.87,28.19 | 88.29,32.05 88.29,34.49 C13.2 | 88.29,32.05 C14.2
$2
  Top 0.305: U$2.2 58.22,29.01 58.22,35.71 JP4.1
  Bottom 0.305: C6.2 64.72,26.37 63.5,25.15 61.06,25.15 60.86,25.35 60.86,29.01 63.5,29.01 64.72,30.23 C4.2 64.52,30.23 60.86,33.88 60.05,33.88 58.22,35.71 JP4.1
$3
  Top 0.305: U$6.4 48.26,33.68 43.59,33.68 43.59,33.88 JP5.1
$12
  Top 0.305: U$1.4 69.19,28.19 69.19,35.31 69.39,35.51 JP2.1
+5V
  Bottom 0.61: 7.82,3.2 3.96,3.2 JP1.1 | 7.82,3.2 8.84,3.2 9.86,2.18 D3.A | 7.82,3.2 7.82,10.72 80.57,10.72 82.8,12.95
A0  (via drill 0.5)
  Top 0.305: 51.82,32.97 51.92,32.87 54.56,32.87 54.56,33.48 R4.2 | 51.82,32.97 51.51,33.27 51.51,35.51 48.46,35.51 U$6.1 | v47.85,18.24 47.85,15.19 51.51,15.19 U$4.36 | v50.29,25.76 51.71,27.18 51.71,32.87 51.82,32.97
  Bottom 0.305: v47.85,18.24 47.85,24.74 49.28,24.74 v50.29,25.76
A5  (via drill 0.5)
  Top 0.305: v46.63,19.05 51.51,19.05 U$4.41
  Bottom 0.305: v46.63,19.05 40.94,24.74 36.88,24.74 33.02,28.6 33.02,30.43 40.13,30.43 40.54,30.84 40.54,35.51 38.51,35.51 IC2.2 38.3,35.71 38.3,36.73 IC2.1
AREF
  Top 0.305: U$4.42 51.71,19.66 54.56,19.66 54.56,18.85 55.98,17.42 C11.1
D6*  (via drill 0.5)
  Top 0.305: v31.6,29.01 30.38,30.23 Q5.1 | v45.42,19.05 45.42,12.75 45.21,12.55 45.21,11.73 U$4.27
  Bottom 0.305: v31.6,29.01 41.55,19.05 v45.42,19.05
D8*  (via drill 0.5)
  Top 0.305: v61.67,6.25 71.83,6.25 Q3.1 | v46.02,4.83 45.82,5.03 U$4.28
  Bottom 0.305: v61.67,6.25 50.7,6.25 49.28,4.83 v46.02,4.83
D+USB
  Top 0.305: R24.2 15.14,14.99 10.67,14.99 10.67,15.19 9.86,16 8.23,16 X4.3
D-USB
  Top 0.305: R31.2 15.14,18.03 10.26,18.03 10.26,17.42 9.86,17.02 8.23,17.02 X4.2
GND  (via drill 0.5)
  Top 0.61: C2.1 23.67,20.07 23.67,14.99 C8.1 23.27,14.78 20.02,11.53 16.56,11.53 | 10.26,11.53 10.26,8.28 8.23,6.25 3.96,6.25 JP1.2 | 10.26,11.53 10.26,14.38 8.23,14.38 X4.5 | 10.26,11.53 16.56,11.53 | 16.56,11.53 v16.56,7.67 | 9.65,25.35 IC1.1 9.86,25.55 15.34,25.55 15.34,27.38 C1.2 16.56,27.58 | 21.03,27.58 19.2,27.58 C5.2 19,27.58 16.56,27.58 | 21.03,27.58 LED3.C | 21.03,31.65 29.57,31.65 | 29.57,31.65 33.63,31.65 34.85,30.43 Q5.3 | 21.03,27.58 21.03,31.65 | U$5.3 18.19,36.12 20.83,36.12 20.83,31.85 21.03,31.65 | v29.57,31.85 29.57,31.65 | 16.56,27.58 16.56,11.53 | 41.76,11.53 41.76,7.47 42.16,7.06 RESET1.4 42.37,6.65 44.4,4.62 44.4,3.81 46.43,3.81 47.04,4.42 47.04,5.44 | 41.76,11.53 U$4.23 | U$4.15 40.13,19.05 41.55,19.05 41.55,11.73 41.76,11.53 | 47.04,5.44 v46.84,5.64 | 55.98,15.6 53.75,15.6 53.14,14.99 53.14,14.17 51.71,14.17 U$4.35 | R3.1 55.98,15.6 | 57.4,15.8 56.18,15.8 55.98,15.6 | 57.4,15.8 57.4,18.44 55.98,19.86 C11.2 55.98,20.68 51.71,20.68 U$4.43 51.51,20.68 48.26,20.68 46.63,22.3 46.63,23.11 U$4.5 46.63,23.32 46.63,25.55 46.02,26.16 C3.1 46.02,26.57 v44.2,28.4 | 56.59,5.44 47.04,5.44 | 56.59,5.44 56.59,10.92 57.4,11.73 57.4,15.8 | U$1.7 76.71,30.84 74.27,30.84 74.27,36.32 72.85,37.74 70.82,37.74 70.82,32.26 U$1.1 70.82,31.85 70.82,30.84 U$1.2 70.82,30.63 70.82,29.62 U$1.3 71.02,29.41 72.24,29.41 72.24,25.76 69.8,23.32 69.8,10.72 | 69.8,10.72 66.95,10.72 66.95,14.38 CFG.1 66.75,12.95 59.44,5.64 59.44,2.18 57.61,2.18 56.59,3.2 56.59,5.44 | 69.8,10.72 70.61,10.72 | 70.61,10.72 71.83,10.72 Q3.3 | 83.62,8.89 83.62,8.08 82.8,7.26 70.61,7.26 70.61,10.72
  Bottom 0.61: CON1.GND 27.94,5.44 27.94,6.86 21.03,6.86 20.42,6.25 C12.1 20.22,6.25 16.76,6.25 C10.2 16.56,6.45 v16.56,7.67 | C7.1 16.56,14.58 13.51,11.53 7.42,11.53 3.96,8.08 3.96,6.25 JP1.2 | 29.57,32.26 28.55,33.27 C16.2 | 36.68,32.26 37.49,32.26 38.3,33.07 IC2.4 | 36.68,32.26 29.57,32.26 | v29.57,31.85 29.57,32.26 | v46.84,5.64 47.85,5.64 48.26,6.05 C9.2 | 36.68,32.26 36.68,37.74 39.73,37.74 41.35,36.12 41.35,28.4 v44.2,28.4
  pour Bottom: -0.1,39.27 97.84,39.27 97.84,-0.76 0,-0.76 0,39.17
GND1
  Bottom 0.457: LED9.C 88.09,20.27 88.09,22.91 87.68,23.32 87.68,24.13 U$3.RUN
GND2
  Bottom 0.457: LED11.C 85.65,20.27 85.65,22.91 86.26,23.52 86.26,24.13 U$3.NET
GND3
  Bottom 0.457: LED12.C 83.21,20.27 83.21,22.71 84.23,22.71 84.84,23.32 84.84,24.13 U$3.ALM
GND_CONTROLLED
  Top 0.61: 74.07,25.96 74.07,29.82 72.24,31.65 72.24,35.51 JP2.2 | 74.07,25.96 74.07,10.52 72.03,8.48 Q3.2 | 74.07,25.96 93.17,25.96 93.78,26.57 93.78,27.58 94.79,28.6 JP13.4
  Bottom 0.61: 62.89,37.74 61.06,35.92 JP4.2 | 70,37.74 62.89,37.74 | 70,37.74 72.03,35.71 JP2.2 | JP3.2 80.98,35.92 78.94,37.95 70.21,37.95 70,37.74 | JP5.2 43.59,36.73 44.81,37.95 62.69,37.95 62.89,37.74
HWB  (via drill 0.5)
  Top 0.305: v47.04,7.87 49.68,10.52 49.68,11.53 U$4.33 | v52.12,7.87 55.98,11.73 R3.2
  Bottom 0.305: v52.12,7.87 v47.04,7.87
ISP+5V  (via drill 0.5)
  Top 0.305: v34.85,5.64 27.74,5.64 27.74,5.44 27.13,4.83 v11.28,4.83
  Bottom 0.305: v34.85,5.64 30.78,5.64 30.58,5.44 CON1.5V | v11.28,4.83 10.06,4.83 D2.A
MISO  (via drill 0.5)
  Top 0.305: v39.12,3.81 39.52,4.22 v39.52,8.48 | v51.31,9.3 54.15,12.14 v54.15,14.58 | v43.79,16.21 43.18,16.81 43.18,21.08 41.96,22.3 41.96,23.11 U$4.11
  Bottom 0.305: v39.12,3.81 30.78,3.81 30.58,4.01 CON1.MISO | v39.52,8.48 40.54,9.5 51.1,9.5 v51.31,9.3 | v54.15,14.58 52.53,16.21 v43.79,16.21
MOSI  (via drill 0.5)
  Top 0.305: v34.85,6.86 36.07,8.08 v36.07,14.58 | v44.4,15.39 44.6,15.6 44.6,17.02 43.79,17.83 43.79,21.29 42.77,22.3 42.77,23.11 U$4.10
  Bottom 0.305: v34.85,6.86 30.78,6.86 29.36,5.44 CON1.MOSI | v36.07,14.58 36.27,14.78 43.79,14.78 v44.4,15.39
N$1  (via drill 0.5)
  Top 0.305: v19.81,37.13 18.19,37.13 18.19,37.54 U$5.4
  Bottom 0.305: R5.2 20.42,37.13 v19.81,37.13 | R5.2
N$2  (via drill 0.5)
  Top 0.305: v33.83,29.01 32.61,30.23 Q5.2 | v58.22,19.25 58.22,4.42 JP6.2
  Bottom 0.305: v33.83,29.01 35.66,27.18 50.29,27.18 v58.22,19.25
N$3
  Bottom 0.305: R5.1 27.13,36.12 | 27.13,36.12 28.35,36.12 C16.1 | 27.13,36.12 27.13,32.46 28.55,31.04 39.93,31.04 39.93,33.48 39.52,33.88 38.91,33.88 38.51,34.29 IC2.3
N$4  (via drill 0.5)
  Top 0.61: JP6.1 60.86,4.42 85.04,4.42 88.7,8.08 88.7,8.89 U$3.GND 88.7,9.09 88.7,10.72 v86.66,10.72
  Bottom 0.61: v86.66,10.72 83.82,10.72 83.82,9.09 U$3.SND
N$6  (via drill 0.5)
  Top 0.305: v60.66,31.24 60.45,31.04 60.45,30.43 U$2.1
  Bottom 0.305: v60.66,31.24 61.06,31.24 61.87,30.43 C4.1
N$11
  Bottom 0.305: R11.2 81.58,3.4 86.26,8.08 86.26,8.89 U$3.RX1
N$13  (via drill 0.5)
  Top 0.305: v82.19,31.04 82.4,31.24 82.4,35.51 85.85,35.51 86.66,34.7 86.66,32.66 85.65,32.66 U2.2
  Bottom 0.305: v82.19,31.04 83.62,29.62 85.24,29.62 C15.1
N$16
  Top 0.305: U$4.6 45.82,23.32 45.62,23.52 45.62,24.13 43.38,26.37 C3.2
N$20
  Top 0.305: LED3.A 25.3,27.58 25.3,30.02 R27.1
N$24
  Bottom 0.305: R8.2 81.58,5.84 83.21,7.47 84.02,7.47 84.84,8.28 84.84,8.89 U$3.TX1
N$25
  Bottom 0.305: LED9.A 88.29,18.03 88.29,14.99 R12.1
N$26
  Bottom 0.305: LED11.A 85.65,18.03 85.65,14.99 R14.1
N$27
  Bottom 0.305: LED12.A 83.21,18.03 83.21,14.99 R39.1
N$35  (via drill 0.5)
  Top 0.305: v73.05,23.11 71.42,21.49 CFG.4
  Bottom 0.305: v73.05,23.11 77.52,23.11 78.54,24.13 U$3.CFG
N$42  (via drill 0.5)
  Top 0.305: 29.97,14.99 C8.2 | U$4.17 38.3,17.42 38.3,17.63 37.69,18.24 v37.69,18.44 | v36.07,18.44 33.83,16.21 R13.2 33.63,16 33.63,14.99 29.97,14.99 | 29.97,14.99 X3.P$2
  Bottom 0.305: v36.07,18.44 v37.69,18.44
RD_N
  Top 0.305: R31.1 arc90 20.68,20.73 20.68,21.49 arc-90 21.84,22.65 28.55,22.65 arc90 30.64,24.74 30.64,27.58 arc-90 31.29,28.24 41.86,28.24 arc90 43.14,29.51 arc-90 43.89,30.27 46.74,30.27 arc-90 47.8,29.21 47.8,25.15 arc-90 48.1,24.84 48.1,23.34 arc90 U$4.3
RD_P
  Top 0.305: R24.1 arc90 21.18,18.05 21.18,21.49 arc-90 21.84,22.16 28.55,22.16 arc90 31.13,24.74 31.13,27.58 arc-90 31.29,27.74 41.86,27.74 arc90 43.63,29.51 arc-90 43.89,29.78 46.74,29.78 arc-90 47.3,29.21 47.3,25.04 arc90 47.61,24.74 47.61,23.41 arc-90 U$4.4
RESET  (via drill 0.5)
  Top 0.305: v37.69,20.47 39.93,20.47 U$4.13 | v24.89,20.27 25.1,20.07 v25.1,5.84 | v42.37,4.22 42.37,2.59 RESET1.2
  Bottom 0.305: 42.37,3.61 44.4,3.61 R15.1 44.6,3.61 48.06,3.61 48.26,3.4 C9.1 | 42.37,3.61 40.54,3.61 39.12,2.18 29.97,2.18 28.14,4.01 CON1.RESET 27.94,4.22 27.53,4.62 26.31,4.62 v25.1,5.84 | v37.69,20.47 37.49,20.27 v24.89,20.27 | 42.37,3.61 v42.37,4.22
RX  (via drill 0.5)
  Top 0.305: v52.32,2.39 51.1,1.17 38.3,1.17 38.3,14.38 38.91,14.99 39.93,14.99 U$4.20
  Bottom 0.305: v52.32,2.39 76.3,2.39 79.55,5.64 R8.1
SCK  (via drill 0.5)
  Top 0.305: v34.85,3 36.88,5.03 36.88,22.5 40.74,26.37 41.96,26.37 41.96,25.15 42.77,24.33 43.38,24.33 43.38,23.32 U$4.9
  Bottom 0.305: v34.85,3 30.38,3 29.36,4.01 CON1.SCK
SCL  (via drill 0.5)
  Top 0.305: v37.69,16.81 39.93,16.81 U$4.18 | R9.2 54.76,28.6 53.34,27.18 53.34,22.91 v53.95,22.3 58.01,22.3 58.01,21.69 60.45,19.25 65.53,19.25 65.53,24.13 67.36,25.96 67.36,31.65 67.26,31.75 | 88.19,34.39 88.29,34.49 94.79,34.49 94.79,33.68 JP13.2 92.46,31.24 92.46,27.38 79.55,27.38 78.74,28.19 78.74,29.41 76.91,29.41 U$1.6 | 88.19,34.39 88.09,34.29 88.09,33.88 U2.8 | 67.26,31.75 68.17,32.66 68.17,36.93 69.8,38.56 88.09,38.56 88.09,34.49 88.19,34.39 | 67.26,31.75 65.94,30.43 U$2.8
  Bottom 0.305: v37.69,16.81 37.9,17.02 48.67,17.02 v53.95,22.3
SDA  (via drill 0.5)
  Top 0.305: U$1.5 76.91,28.19 78.33,26.77 92.96,26.77 92.96,29.01 95,31.04 JP13.3 | v37.69,15.8 39.93,15.8 U$4.19 | 62.79,22 61.67,23.11 R2.1 | 62.79,22 v63.09,21.69 | U$2.7 62.89,29.01 62.89,22.1 62.79,22 | U2.7 91.02,32.58 v91.14,32.46
  Bottom 0.305: v37.69,15.8 37.29,15.39 35.66,15.39 35.26,14.99 35.26,13.77 55.17,13.77 v63.09,21.69 67.16,25.76 89.71,25.76 95,31.04 JP13.3 93.83,32.46 v91.14,32.46
TX  (via drill 0.5)
  Top 0.305: v40.13,1.98 40.34,2.18 40.34,8.89 38.91,10.31 38.91,14.17 39.93,14.17 U$4.21
  Bottom 0.305: v40.13,1.98 40.54,1.57 77.93,1.57 79.55,3.2 R11.1
VCC  (via drill 0.5)
  Top 0.305: v50.5,8.69 50.5,12.34 51.51,13.36 U$4.34 | U$4.44 51.51,21.49 49.89,21.49 49.07,22.3 49.07,23.11 U$4.2 48.87,23.32 v48.87,25.55 | 41.15,19.86 40.13,19.86 U$4.14 | 41.15,19.86 41.76,19.86 42.57,19.05 42.57,11.73 U$4.24 42.77,11.53 42.77,10.72 v44.81,8.69 | 41.15,19.86 v41.15,25.55 | v13.51,30.23 19,30.23 C5.1 | v11.28,30.23 9.65,30.23 9.65,30.02 IC1.3
  Bottom 0.305: v50.5,8.69 46.63,8.69 45.72,7.77 | 44.7,6.76 44.6,6.65 44.6,5.84 R15.2 | 44.7,6.76 45.72,7.77 | v41.15,25.55 v48.87,25.55 | v44.81,8.69 45.72,7.77 | v13.51,30.23 v11.28,30.23 1.93,20.88 1.93,0.97 11.68,0.97 12.9,2.18 D3.C 13.11,2.18 13.11,3.4 | 13.11,3.4 13.11,4.62 D2.C 13.11,4.83 13.11,7.26 | 13.11,3.4 16.56,3.4 C10.1 16.76,3.4 20.42,3.4 C12.2 | 44.7,6.76 43.79,7.67 17.78,7.67 16.97,8.48 14.33,8.48 13.11,7.26 | 13.11,7.26 D4.C
VUSB  (via drill 0.5)
  Top 0.305: v8.84,8.28 5.99,8.28 5.99,13.56 6.2,13.77 6.2,17.42 6.4,17.63 8.03,17.63 X4.1 8.23,17.83 v9.04,18.64 | v44.6,18.24 44.6,19.46 45.01,19.86 45.01,23.11 U$4.7
  Bottom 0.305: v8.84,8.28 9.86,7.26 D4.A | v44.6,18.24 43.99,17.63 16.76,17.63 C7.2 16.56,17.63 10.06,17.63 v9.04,18.64
XTAL1  (via drill 0.5)
  Top 0.305: 29.97,20.07 C2.2 | v37.69,19.46 37.9,19.46 38.51,18.85 38.51,18.24 39.93,18.24 U$4.16 | 33.83,19.46 v35.46,19.46 | 33.83,19.46 33.83,19.05 R13.1 33.83,19.46 | 29.97,20.07 33.83,20.07 33.83,19.46 | 29.97,20.07 X3.P$1
  Bottom 0.305: v35.46,19.46 v37.69,19.46

### Text on the board
tNames: 1 | 1 | Solar Decathlon v1.1
bNames: USB | TX/RX | LINKLED
tValues: GND_CTRL SDA SCL 3.3V
203bmp: C:/Users/G/Pictures/logo_epfl.bmp